# EAGLE design Layer4 (EAGLE 9.6.1)

## Sheet 1 of 2
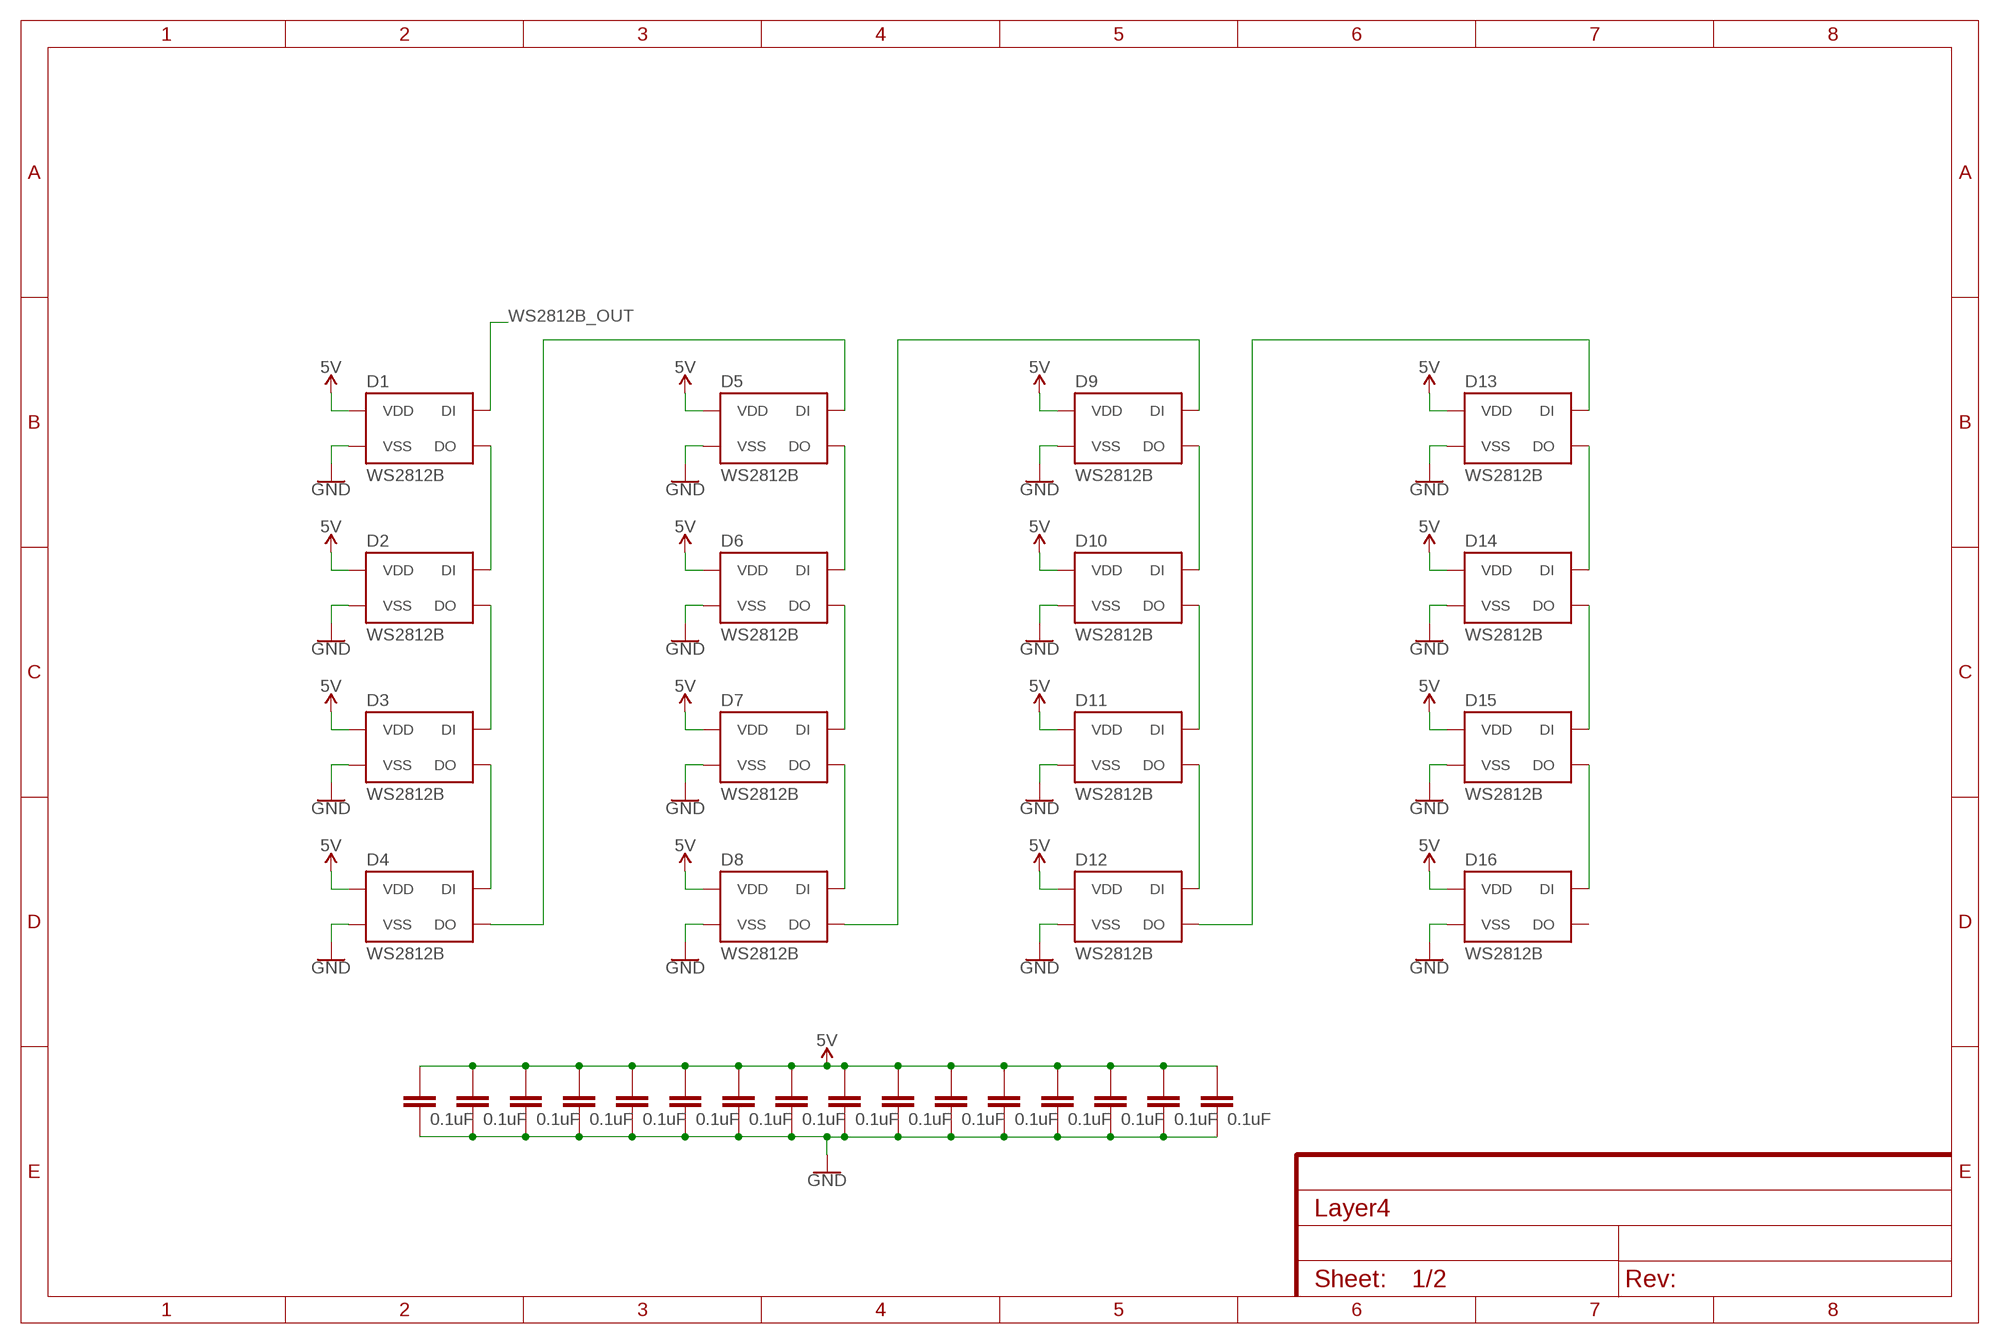
[diagram p0: schematic, sheet 1]

### Parts
AC1  0.1uF  CAPACITOR0603  [C0603]
AC2  0.1uF  CAPACITOR0603  [C0603]
AC3  0.1uF  CAPACITOR0603  [C0603]
AC4  0.1uF  CAPACITOR0603  [C0603]
AC5  0.1uF  CAPACITOR0603  [C0603]
AC6  0.1uF  CAPACITOR0603  [C0603]
AC7  0.1uF  CAPACITOR0603  [C0603]
AC8  0.1uF  CAPACITOR0603  [C0603]
C1  0.1uF  CAPACITOR0603  [C0603]
C3  0.1uF  CAPACITOR0603  [C0603]
C5  0.1uF  CAPACITOR0603  [C0603]
C7  0.1uF  CAPACITOR0603  [C0603]
C9  0.1uF  CAPACITOR0603  [C0603]
C11  0.1uF  CAPACITOR0603  [C0603]
C13  0.1uF  CAPACITOR0603  [C0603]
C15  0.1uF  CAPACITOR0603  [C0603]
D1  WS2812B  [WS2812B]
D2  WS2812B  [WS2812B]
D3  WS2812B  [WS2812B]
D4  WS2812B  [WS2812B]
D5  WS2812B  [WS2812B]
D6  WS2812B  [WS2812B]
D7  WS2812B  [WS2812B]
D8  WS2812B  [WS2812B]
D9  WS2812B  [WS2812B]
D10  WS2812B  [WS2812B]
D11  WS2812B  [WS2812B]
D12  WS2812B  [WS2812B]
D13  WS2812B  [WS2812B]
D14  WS2812B  [WS2812B]
D15  WS2812B  [WS2812B]
D16  WS2812B  [WS2812B]

### Nets
5V: AC1.1 AC2.1 AC3.1 AC4.1 AC5.1 AC6.1 AC7.1 AC8.1 C1.1 C3.1 C5.1 C7.1 C9.1 C11.1 C13.1 C15.1 D1.1(VDD) D2.1(VDD) D3.1(VDD) D4.1(VDD) D5.1(VDD) D6.1(VDD) D7.1(VDD) D8.1(VDD) D9.1(VDD) D10.1(VDD) D11.1(VDD) D12.1(VDD) D13.1(VDD) D14.1(VDD) D15.1(VDD) D16.1(VDD) ; also sheet 2
GND: AC1.2 AC2.2 AC3.2 AC4.2 AC5.2 AC6.2 AC7.2 AC8.2 C1.2 C3.2 C5.2 C7.2 C9.2 C11.2 C13.2 C15.2 D1.3(VSS) D2.3(VSS) D3.3(VSS) D4.3(VSS) D5.3(VSS) D6.3(VSS) D7.3(VSS) D8.3(VSS) D9.3(VSS) D10.3(VSS) D11.3(VSS) D12.3(VSS) D13.3(VSS) D14.3(VSS) D15.3(VSS) D16.3(VSS) ; also sheet 2
N$3: D1.2(DO) D2.4(DI)
N$5: D2.2(DO) D3.4(DI)
N$6: D3.2(DO) D4.4(DI)
N$7: D4.2(DO) D5.4(DI)
N$8: D5.2(DO) D6.4(DI)
N$9: D6.2(DO) D7.4(DI)
N$10: D7.2(DO) D8.4(DI)
N$11: D8.2(DO) D9.4(DI)
N$12: D9.2(DO) D10.4(DI)
N$13: D10.2(DO) D11.4(DI)
N$14: D11.2(DO) D12.4(DI)
N$15: D12.2(DO) D13.4(DI)
N$16: D13.2(DO) D14.4(DI)
N$17: D14.2(DO) D15.4(DI)
N$18: D15.2(DO) D16.4(DI)
WS2812B_OUT: D1.4(DI) ; also sheet 2
Unconnected: D16.2(DO)

## Sheet 2 of 2
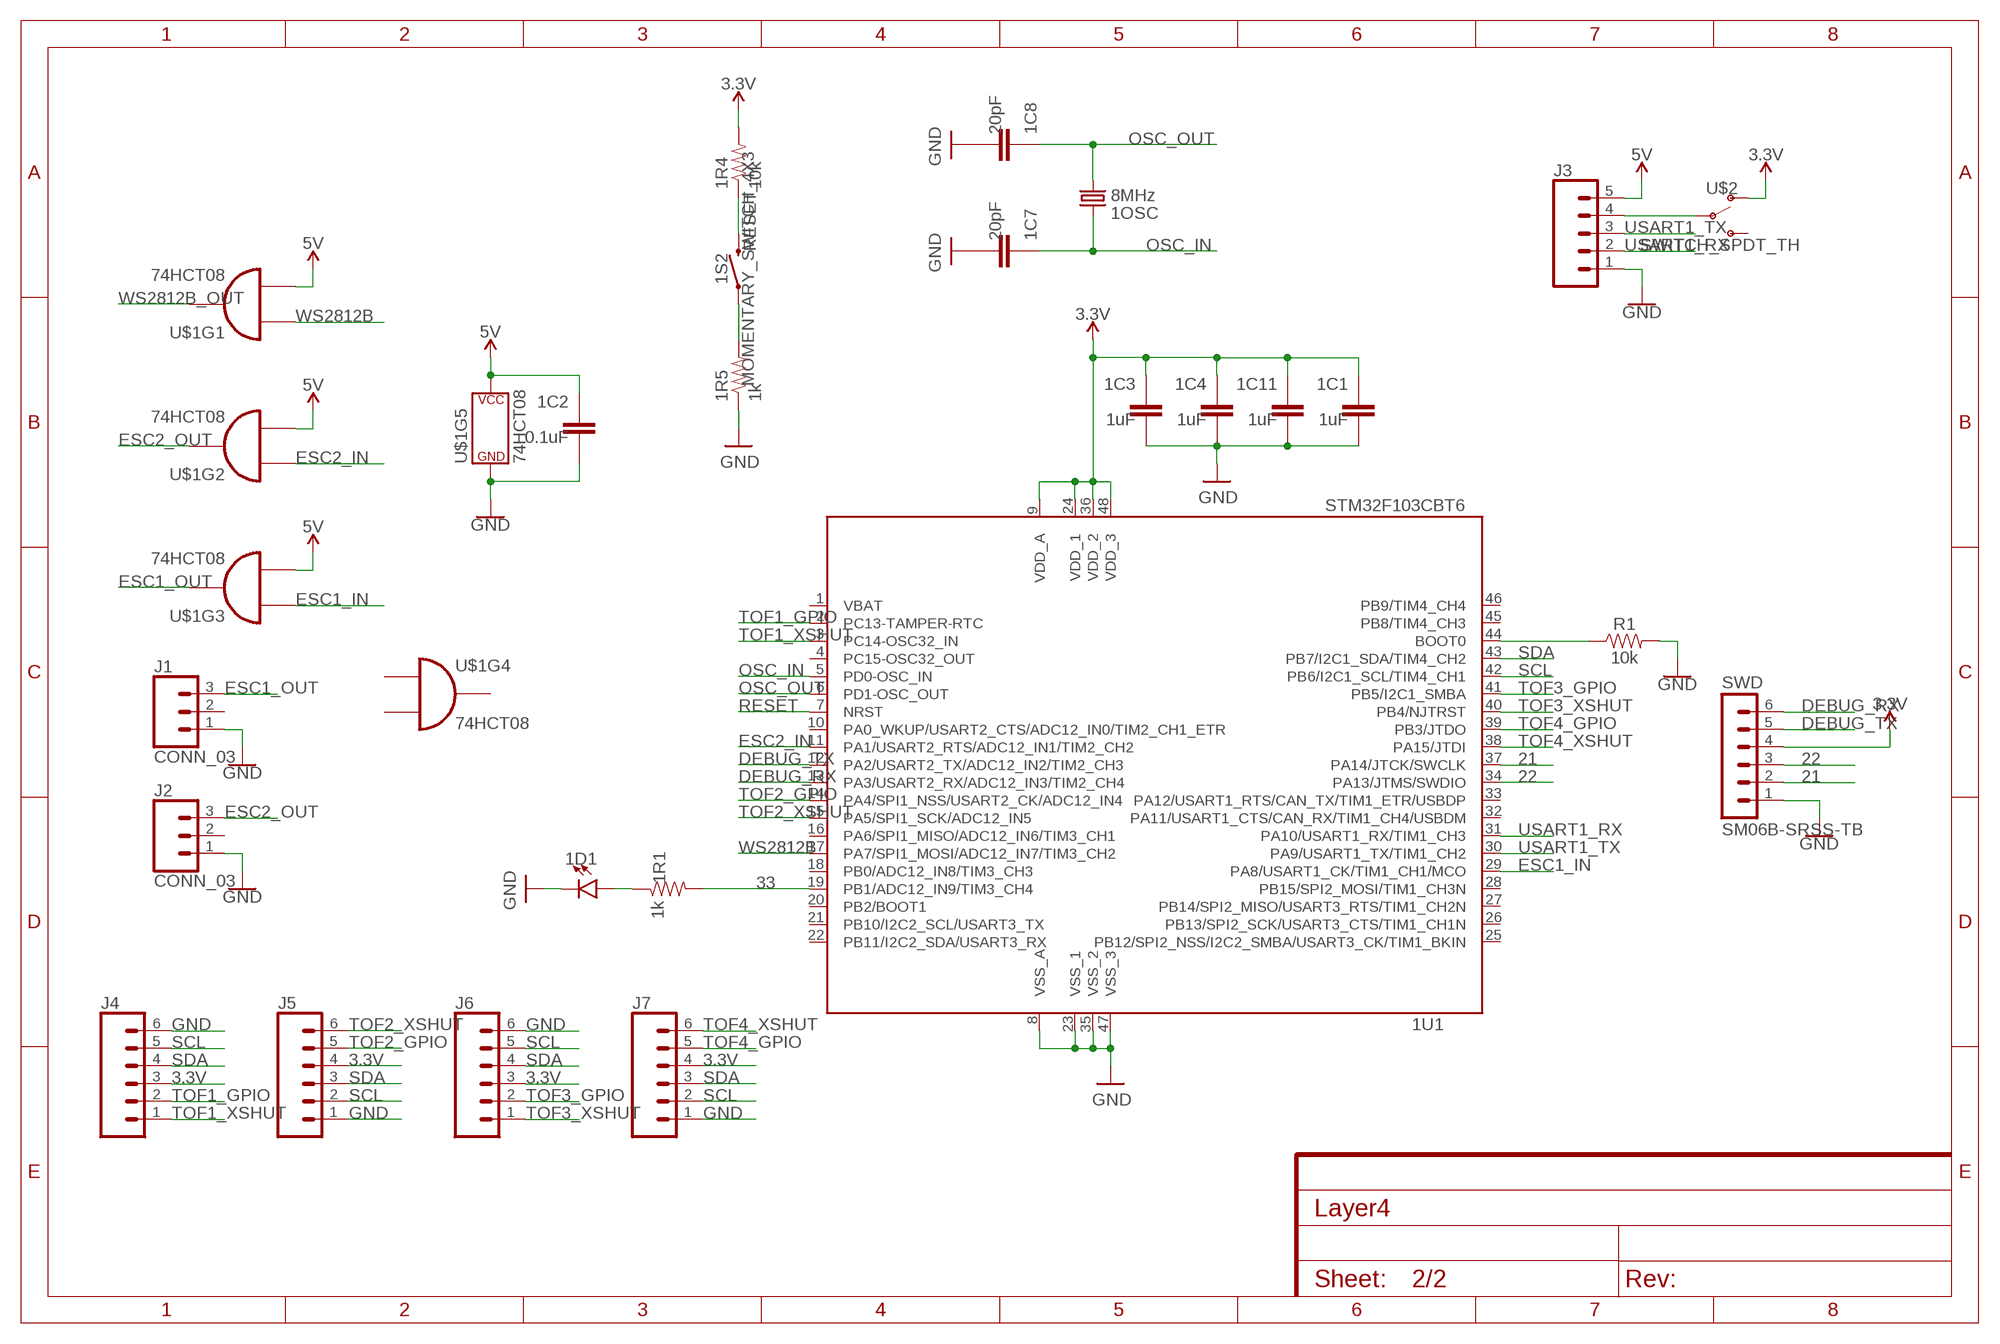
[diagram p1: schematic, sheet 2]

### Parts
1C1  1uF  CAPACITOR0603  [C0603]
1C2  0.1uF  CAPACITOR0603  [C0603]
1C3  1uF  CAPACITOR0603  [C0603]
1C4  1uF  CAPACITOR0603  [C0603]
1C7  20pF  CAPACITOR0603  [C0603]
1C8  20pF  CAPACITOR0603  [C0603]
1C11  1uF  CAPACITOR0603  [C0603]
1D1  BLUE  LED0603  [LED-0603]
1OSC  8MHz  CRYSTAL_5032  [CRYSTAL-SMD-5X3.2-2PAD]
1R1  1k  RESISTOR0603  [R0603]
1R4  10k  RESISTOR0603  [R0603]
1R5  1k  RESISTOR0603  [R0603]
1S2  MOMENTARY_SWITCH_4X3  [MOMENTARY_SWITCH_4X3]
1U1  STM32F103CBT6  [LQFP48]
J1  CONN_03  [1X03_LOCK]
J2  CONN_03  [1X03_LOCK]
J3  CONN_05LOCK  [1X05_LOCK]
J4  CONN_06LOCK  [1X06_LOCK]
J5  CONN_06LOCK  [1X06_LOCK]
J6  CONN_06LOCK  [1X06_LOCK]
J7  CONN_06LOCK  [1X06_LOCK]
R1  10k  RESISTOR0603  [R0603]
SWD  SM06B-SRSS-TB  [SM06B-SRSS-TB]
U$1  74HCT08  [SOIC-14]
U$2  SWITCH_SPDT_TH  [SWITCH_SPDT_PTH_11.6X4.0MM_LOCK]

### Nets
3.3V: 1C1.1 1C3.1 1C4.1 1C11.1 1R4.2 1U1.9(VDD_A) 1U1.24(VDD_1) 1U1.36(VDD_2) 1U1.48(VDD_3) J4.3 J5.4 J6.3 J7.4 SWD.4 U$2.1(O)
5V: 1C2.1 J3.5 U$1.P2(I1) U$1.P5(I1) U$1.P10(I1) U$1.P14(P$V+) ; also sheet 1
21: 1U1.37(PA14/JTCK/SWCLK) SWD.2
22: 1U1.34(PA13/JTMS/SWDIO) SWD.3
33: 1R1.2 1U1.19(PB1/ADC12_IN9/TIM3_CH4)
DEBUG_RX: 1U1.13(PA3/USART2_RX/ADC12_IN3/TIM2_CH4) SWD.6
DEBUG_TX: 1U1.12(PA2/USART2_TX/ADC12_IN2/TIM2_CH3) SWD.5
ESC1_IN: 1U1.29(PA8/USART1_CK/TIM1_CH1/MCO) U$1.P9(I0)
ESC1_OUT: J1.3 U$1.P8(O)
ESC2_IN: 1U1.11(PA1/USART2_RTS/ADC12_IN1/TIM2_CH2) U$1.P4(I0)
ESC2_OUT: J2.3 U$1.P6(O)
GND: 1C1.2 1C2.2 1C3.2 1C4.2 1C7.2 1C8.2 1C11.2 1D1.C 1R5.1 1U1.8(VSS_A) 1U1.23(VSS_1) 1U1.35(VSS_2) 1U1.47(VSS_3) J1.1 J2.1 J3.1 J4.6 J5.1 J6.6 J7.1 R1.2 SWD.1 U$1.P7(P$V-) ; also sheet 1
N$2: 1D1.A 1R1.1
N$4: 1R5.2 1S2.P$1
N$23: 1U1.44(BOOT0) R1.1
N$26: J3.4 U$2.2(P)
OSC_IN: 1C7.1 1OSC.P$2 1U1.5(PD0-OSC_IN)
OSC_OUT: 1C8.1 1OSC.P$1 1U1.6(PD1-OSC_OUT)
RESET: 1R4.1 1S2.P$2 1U1.7(NRST)
SCL: 1U1.42(PB6/I2C1_SCL/TIM4_CH1) J4.5 J5.2 J6.5 J7.2
SDA: 1U1.43(PB7/I2C1_SDA/TIM4_CH2) J4.4 J5.3 J6.4 J7.3
TOF1_GPIO: 1U1.2(PC13-TAMPER-RTC) J4.2
TOF1_XSHUT: 1U1.3(PC14-OSC32_IN) J4.1
TOF2_GPIO: 1U1.14(PA4/SPI1_NSS/USART2_CK/ADC12_IN4) J5.5
TOF2_XSHUT: 1U1.15(PA5/SPI1_SCK/ADC12_IN5) J5.6
TOF3_GPIO: 1U1.41(PB5/I2C1_SMBA) J6.2
TOF3_XSHUT: 1U1.40(PB4/NJTRST) J6.1
TOF4_GPIO: 1U1.39(PB3/JTDO) J7.5
TOF4_XSHUT: 1U1.38(PA15/JTDI) J7.6
USART1_RX: 1U1.31(PA10/USART1_RX/TIM1_CH3) J3.2
USART1_TX: 1U1.30(PA9/USART1_TX/TIM1_CH2) J3.3
WS2812B: 1U1.17(PA7/SPI1_MOSI/ADC12_IN7/TIM3_CH2) U$1.P1(I0)
WS2812B_OUT: U$1.P3(O) ; also sheet 1
Unconnected: 1U1.4(PC15-OSC32_OUT) 1U1.10(PA0_WKUP/USART2_CTS/ADC12_IN0/TIM2_CH1_ETR) 1U1.16(PA6/SPI1_MISO/ADC12_IN6/TIM3_CH1) 1U1.18(PB0/ADC12_IN8/TIM3_CH3) 1U1.20(PB2/BOOT1) 1U1.21(PB10/I2C2_SCL/USART3_TX) 1U1.22(PB11/I2C2_SDA/USART3_RX) 1U1.25(PB12/SPI2_NSS/I2C2_SMBA/USART3_CK/TIM1_BKIN) 1U1.26(PB13/SPI2_SCK/USART3_CTS/TIM1_CH1N) 1U1.27(PB14/SPI2_MISO/USART3_RTS/TIM1_CH2N) 1U1.28(PB15/SPI2_MOSI/TIM1_CH3N) 1U1.32(PA11/USART1_CTS/CAN_RX/TIM1_CH4/USBDM) 1U1.33(PA12/USART1_RTS/CAN_TX/TIM1_ETR/USBDP) 1U1.45(PB8/TIM4_CH3) 1U1.46(PB9/TIM4_CH4) J1.2 J2.2 U$1.P11(O) U$1.P12(I0) U$1.P13(I1) U$2.3(S)

## Power pins joined to a net without a drawn wire
VBAT: 1U1.1(VBAT)

## Library data of the parts
1C1-1C4 1C7 1C8 1C11 AC1-AC8 C1 C3 C5 C7 C9 C11 C13 C15 = JH:CAPACITOR
1D1 = JH:LED: Blue SMD LED Used in manufacturing of various products at SparkFun Packages: 0603 - SMD 0603 package [Product Link] <http://www.digikey.com/product-detail/en/SMLE12BC7TT86/511-1589-2-ND/1641808> 1206 - SMD1206 package [Product Link] <http://www.digikey.com/product-detail/en/lite-on-inc/LTST-C150TBKT/160-1643-1-ND/573584> SparkFun Products: ESP8266 Thing-Dev Board <https://www.sparkfun.com/products/13711> RedBoard <https://www.sparkfun.com/products/12757>
1OSC = JH:CRYSTAL: Crystals (Generic) These are passive quartz crystals, which can be used as a clock source for a microcontroller. Crystal's are two-terminal devices. They require external "load" capacitors to generate an oscillating signal.
1R1 1R4 1R5 R1 = JH:RESISTOR
1S2 = JH:MOMENTARY_SWITCH_4X3
1U1 = JH:STM32F103CBT6
D1-D16 = JH:WS2812B
J1 J2 = JH:CONN_03
J3 = Connectors:CONN_05: Multi connection point. Often used as Generic Header-pin footprint for 0.1 inch spaced/style header connections On any of the 0.1 inch spaced packages, you can populate with these: Break Away Headers - Straight <https://www.sparkfun.com/products/116> (PRT-00116) Break Away Male Headers - Right Angle <https://www.sparkfun.com/products/553> (PRT-00553) Female Headers <https://www.sparkfun.com/products/115> (PRT-00115) Break Away Headers - Machine Pin <https://www.sparkfun.com/products/117> (PRT-00117) Break Away Female Headers - Swiss Machine Pin <https://www.sparkfun.com/products/743> (PRT-00743) For SCREWTERMINALS and SPRING TERMINALS visit here: Screw Terimnals on SparkFun.com <https://www.sparkfun.com/search/results?term=Screw+Terminals> (5mm/3.5mm/2.54mm spacing) This device is also useful as a general connection point to wire up your design to another part of your project. Our various solder wires solder well into these plated through hole pads. Hook-Up Wire - Assortment (Stranded, 22 AWG) <https://www.sparkfun.com/products/11375> (PRT-11375) Hook-Up Wire - Assortment (Solid Core, 22 AWG) <https://www.sparkfun.com/products/11367> (PRT-11367) View the entire wire category on our website here <https://www.sparkfun.com/categories/141> Special notes: Molex polarized connector foot print use with SKU : PRT-08231 with associated crimp pins and housings. 1MM SMD Version SKU: PRT-10208
J4-J7 = Connectors:CONN_06: Multi connection point. Often used as Generic Header-pin footprint for 0.1 inch spaced/style header connections On any of the 0.1 inch spaced packages, you can populate with these: Break Away Headers - Straight <https://www.sparkfun.com/products/116> (PRT-00116) Break Away Male Headers - Right Angle <https://www.sparkfun.com/products/553> (PRT-00553) Female Headers <https://www.sparkfun.com/products/115> (PRT-00115) Break Away Headers - Machine Pin <https://www.sparkfun.com/products/117> (PRT-00117) Break Away Female Headers - Swiss Machine Pin <https://www.sparkfun.com/products/743> (PRT-00743) Arduino Stackable Header - 6 Pin <https://www.sparkfun.com/products/9280> (PRT-09280) For SCREWTERMINALS and SPRING TERMINALS visit here: Screw Terimnals on SparkFun.com <https://www.sparkfun.com/search/results?term=Screw+Terminals> (5mm/3.5mm/2.54mm spacing) This device is also useful as a general connection point to wire up your design to another part of your project. Our various solder wires solder well into these plated through hole pads. Hook-Up Wire - Assortment (Stranded, 22 AWG) <https://www.sparkfun.com/products/11375> (PRT-11375) Hook-Up Wire - Assortment (Solid Core, 22 AWG) <https://www.sparkfun.com/products/11367> (PRT-11367) View the entire wire category on our website here <https://www.sparkfun.com/categories/141>
SWD = con-JST SH:SM06B-SRSS: JST SH series header 1.00mm pitch disconnectable crimp style connectors, horizontal (side entry type), 6 pins
U$1 = JH:74HCT08
U$2 = JH:SWITCH_SPDT

## Board
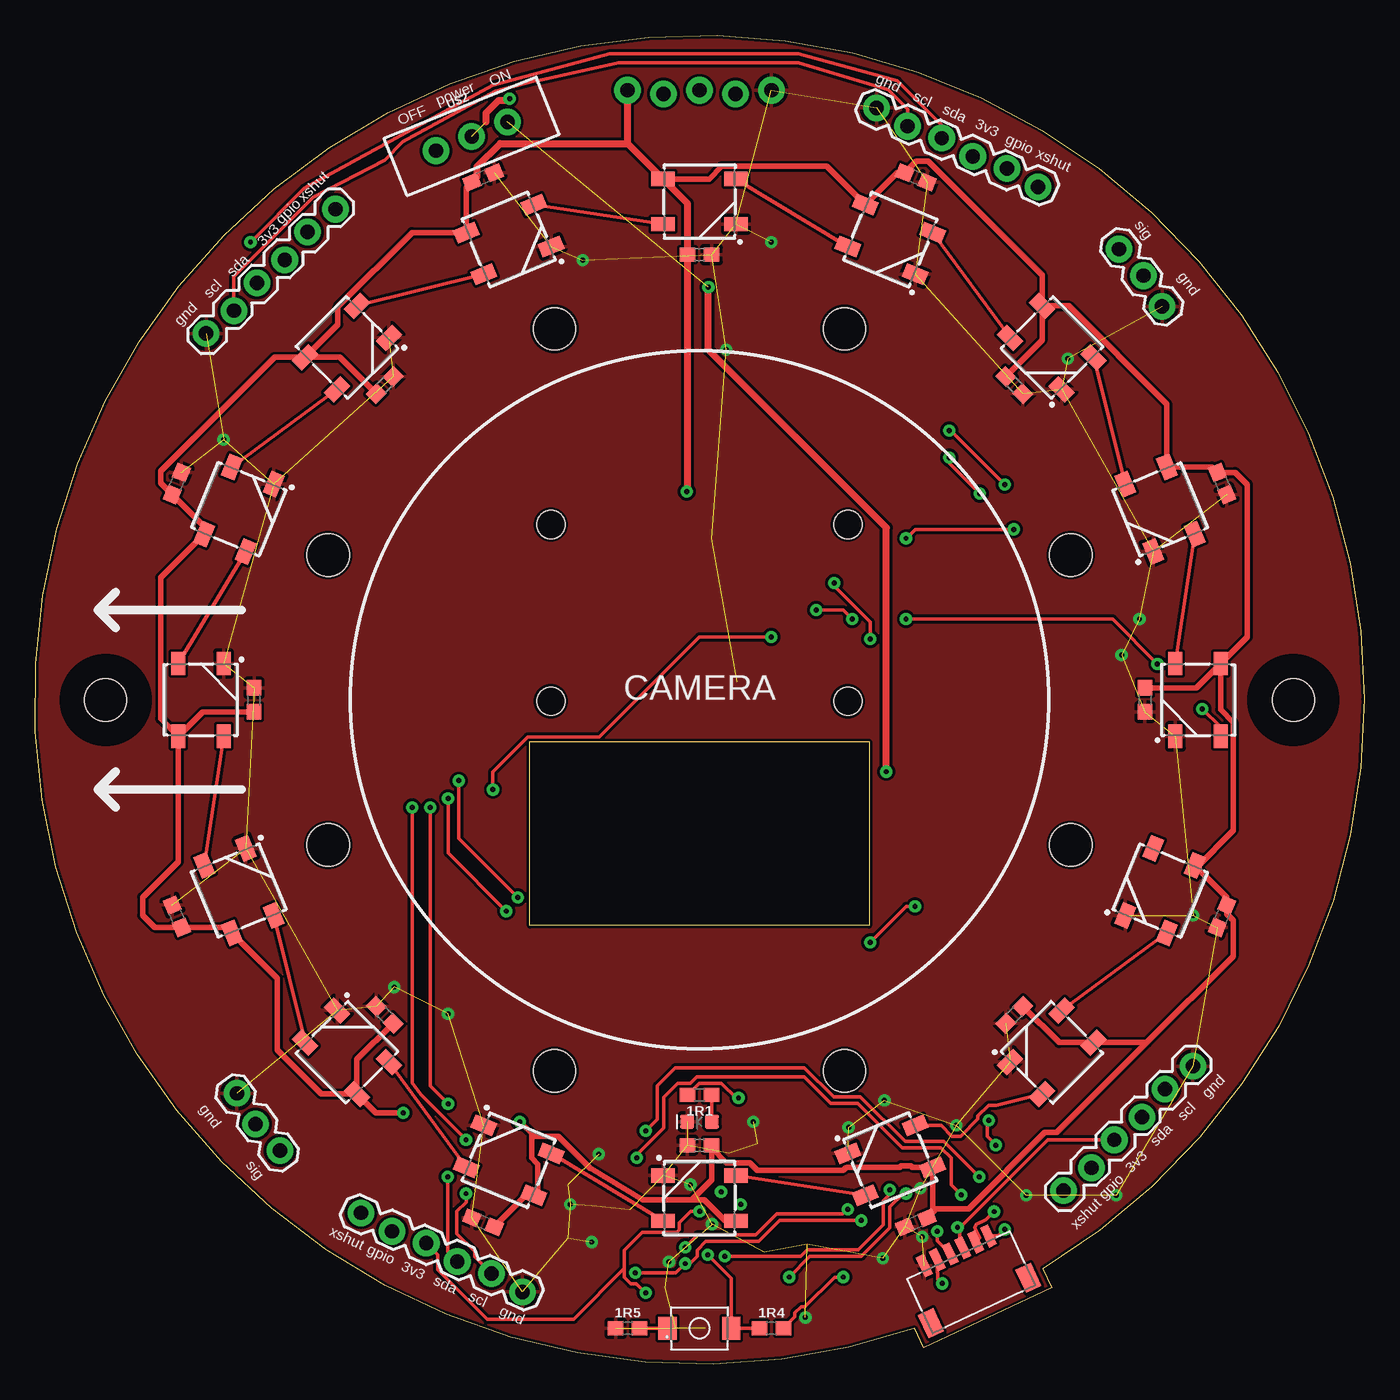
[diagram p2: board, top side]
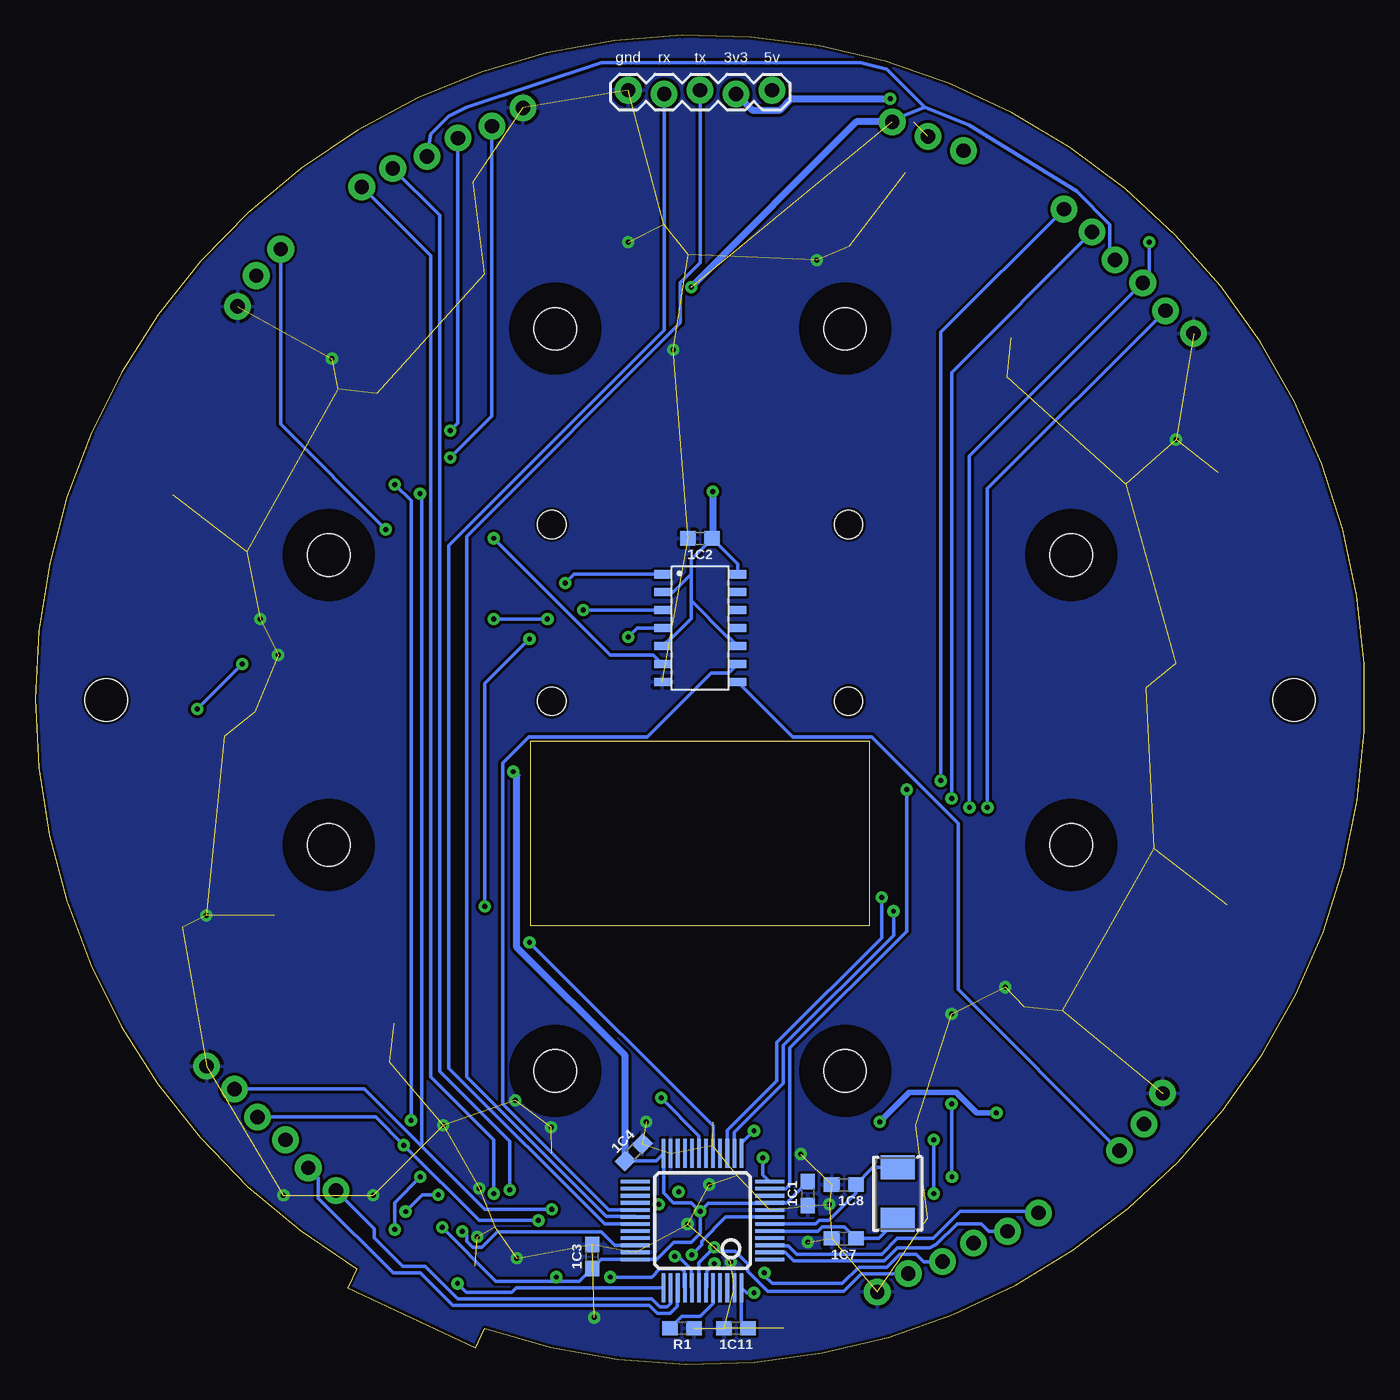
[diagram p3: board, bottom side, seen from below]

Size 93.97 x 94 mm. Coordinates in mm from the lower left corner, seen from the top.
Outline: 71.88,5.39 62.82,1.16 62.18,2.52 arc-348 71.25,6.75 71.88,5.39
Outline: 34.96,44.03 58.96,44.03 58.96,31.03 34.96,31.03 34.96,44.03
Copper layers (1*16): Top 0.035mm / dielectric 1.5mm / Bottom 0.035mm
Design rules "mine *": minimum track width 10mil, minimum drill 10mil, track to track 8mil, track to pad 8mil, pad to pad 8mil, via to via 8mil, smd to smd 8mil, copper to edge 8mil, drill to drill 8mil, minimum pad ring 12mil, minimum via ring 10mil, stop-mask expansion 4mil, vias tented up to drill 25mil, thermal gap 10mil
Holes 3 mm at 4.96,46.99 20.71,36.74 20.71,57.24 36.71,73.24 57.21,73.24 73.21,57.24 73.21,36.74 57.21,20.74 36.71,20.74 88.96,46.99
Holes 2 mm at 57.46,59.39 57.46,46.89 36.46,46.89 36.46,59.39
tKeepout: 24 lines
bKeepout: 24 lines
tRestrict: area 2,44 to 8,50; area 86,44 to 92,50
bRestrict: area 17.7,54.2 to 23.7,60.2; area 17.7,33.7 to 23.7,39.7; area 33.7,17.7 to 39.7,23.7; area 54.2,17.7 to 60.2,23.7; area 70.2,33.7 to 76.2,39.7; area 70.2,54.2 to 76.2,60.2; area 54.2,70.2 to 60.2,76.2; area 33.7,70.2 to 39.7,76.2
Milling: 4 lines

### Footprints (pad centres in the part's own frame; a part is rotated, then mirrored left to right if it is on the bottom)
C0603 = smd 1.1 x 1: 1 -0.85,0; 2 0.85,0
LED-0603 = smd 1 x 1: A -0.877,0; C 0.877,0
CRYSTAL-SMD-5X3.2-2PAD = smd 1.7 x 2.4: P$1 1.85,0; P$2 -1.85,0
R0603 = smd 1.1 x 1: 1 -0.85,0; 2 0.85,0
MOMENTARY_SWITCH_4X3 = smd 1.3 x 1.6: P$1 -2.25,0; P$2 2.25,0
LQFP48 = smd 0.254 x 2.032: 1 -2.75,-4.758; 2 -2.25,-4.758; 3 -1.75,-4.758; 4 -1.25,-4.758; 5 -0.75,-4.758; 6 -0.25,-4.758; 7 0.25,-4.758; 8 0.75,-4.758; 9 1.25,-4.758; 10 1.75,-4.758; 11 2.25,-4.758; 12 2.75,-4.758; 25 2.75,4.758; 26 2.25,4.758; 27 1.75,4.758; 28 1.25,4.758; 29 0.75,4.758; 30 0.25,4.758; 31 -0.25,4.758; 32 -0.75,4.758; 33 -1.25,4.758; 34 -1.75,4.758; 35 -2.25,4.758; 36 -2.75,4.758 | smd 2.032 x 0.254: 13 4.758,-2.75; 14 4.758,-2.25; 15 4.758,-1.75; 16 4.758,-1.25; 17 4.758,-0.75; 18 4.758,-0.25; 19 4.758,0.25; 20 4.758,0.75; 21 4.758,1.25; 22 4.758,1.75; 23 4.758,2.25; 24 4.758,2.75; 37 -4.758,2.75; 38 -4.758,2.25; 39 -4.758,1.75; 40 -4.758,1.25; 41 -4.758,0.75; 42 -4.758,0.25; 43 -4.758,-0.25; 44 -4.758,-0.75; 45 -4.758,-1.25; 46 -4.758,-1.75; 47 -4.758,-2.25; 48 -4.758,-2.75
WS2812B = smd 1.651 x 1: 1 2.577,-1.6; 2 2.577,1.6; 3 -2.577,1.6; 4 -2.577,-1.6
1X03_LOCK = drill 1.016 pad 1.88: 1 0,0.127; 2 2.54,-0.127; 3 5.08,0.127
1X05_LOCK = drill 1.016 pad 1.88: 1 0,0.127; 2 2.54,-0.127; 3 5.08,0.127; 4 7.62,-0.127; 5 10.16,0.127
1X06_LOCK = drill 1.016 pad 1.88: 1 0,0; 2 2.54,-0.254; 3 5.08,0; 4 7.62,-0.254; 5 10.16,0; 6 12.7,-0.254
SM06B-SRSS-TB = smd 0.6 x 1.55: 1 2.5,0; 2 1.5,0; 3 0.5,0; 4 -0.5,0; 5 -1.5,0; 6 -2.5,0 | smd 1.2 x 1.8: M1 3.8,3.875; M2 -3.8,3.875
SOIC-14 = smd 1.18 x 0.58: P1 -2.66,3.81; P2 -2.66,2.54; P3 -2.66,1.27; P4 -2.66,0; P5 -2.66,-1.27; P6 -2.66,-2.54; P7 -2.66,-3.81; P8 2.66,-3.81; P9 2.66,-2.54; P10 2.66,-1.27; P11 2.66,0; P12 2.66,1.27; P13 2.66,2.54; P14 2.66,3.81
SWITCH_SPDT_PTH_11.6X4.0MM_LOCK = drill 1.016 pad 1.88: 1 0,2.718; 2 0,0; 3 0,-2.718

### Placement (x,y rotation side)
1C1  39.34,12.07 270 bottom
1C2  46.96,58.42 180 bottom
1C3  54.58,7.62 90 bottom
1C4  51.66,14.99 45 bottom
1C7  36.8,8.89 180 bottom
1C8  36.8,12.7 180 bottom
1C11  44.42,2.54 180 bottom
1D1  46.96,17.15 180 top
1OSC  32.99,12.07 90 bottom
1R1  46.96,19.05 180 top
1R4  52.04,2.54 0 top
1R5  41.88,2.54 0 top
1S2  46.96,2.54 0 top
1U1  46.79,10.16 90 bottom
AC1  83.92,62.3 292.5 top
AC2  62.27,83.95 337.5 top
AC3  31.66,83.95 22.5 top
AC4  10.01,62.3 67.5 top
AC5  10.01,31.68 112.5 top
AC6  31.66,10.04 157.5 top
AC7  62.27,10.04 202.5 top
AC8  83.92,31.68 247.5 top
C1  78.46,46.99 270 top
C3  69.24,69.26 315 top
C5  46.96,78.49 0 top
C7  24.69,69.26 45 top
C9  15.46,46.99 90 top
C11  24.69,24.72 135 top
C13  46.96,15.49 180 top
C15  69.24,24.72 225 top
D1  82.21,46.99 90 top
D2  79.53,60.48 112.5 top
D3  71.89,71.92 135 top
D4  60.45,79.56 157.5 top
D5  46.96,82.24 180 top
D6  33.47,79.56 202.5 top
D7  22.04,71.92 225 top
D8  14.4,60.48 247.5 top
D9  11.71,46.99 270 top
D10  14.4,33.5 292.5 top
D11  22.04,22.07 315 top
D12  33.47,14.42 337.5 top
D13  46.96,11.74 0 top
D14  60.45,14.42 22.5 top
D15  71.89,22.07 45 top
D16  79.53,33.5 67.5 top
J1  14.15,19.08 307 top
J2  79.78,74.9 127 top
J3  52.04,89.99 0 bottom
J4  23.04,10.7 335 top
J5  12.07,72.91 45 top
J6  70.89,83.28 155 top
J7  81.86,21.08 225 top
R1  48.23,2.54 0 bottom
SWD  65.14,8.02 205 top
U$1  46.96,52.07 0 bottom
U$2  30.86,86.86 292 top

### Tracks (layer width: path | path; a pad name or v marks a point on that pad's centre or on a via)
3.3V  (via drill 0.35)  (1 unrouted)
  Top 0.254: J7.4 71.61,15.87 65.38,9.64 65.38,9.5 | 41.65,6.77 41.65,6.14 42.1,5.7 42.5,5.7 v43.15,5.04 | 41.65,6.77 41.65,8.04 42.92,9.31 45.35,9.31 45.54,9.5 45.54,10.01 46.33,10.8 v46.96,10.8 v46.97,10.8 | J4.3 28.46,7.73 28.46,6.68 31.97,3.18 38.06,3.18 41.65,6.77 | SWD.4 65.38,8.44 65.38,9.5 | v65.21,9.67 65.38,9.5 | v57.12,6.16 56.52,6.16 54.42,4.06 54.14,4.06 53.7,3.62 53.7,3.34 1R4.2
  Top 0.508: v60.18,41.91 60.18,59.18 47.6,71.76 v47.6,76.2
  Bottom 0.254: 1C11.1 44.04,3.01 1U1.48 43.68,5.04 v43.15,5.04 | 1C4.1 50.08,14.39 1U1.24 49.54,12.11 48.87,11.43 47.6,11.43 v46.97,10.8 | 1C1.1 40.85,11.41 1U1.9 42.08,11.37 46.4,11.37 v46.97,10.8 | J6.3 66.01,87 64.74,88.27 63.47,88.9 53.95,92.08 35.59,92.08 33.78,91.59 31.09,88.9 | J5.4 17.98,78.46 17.98,80.62 20.34,82.98 27.91,87.63 31.09,88.9 | v46.97,10.8 46.97,9.26 47.6,8.63 48.81,8.63 50.03,7.41 1U1.36 53.94,7.41 1C3.1 55.5,5.86 56.82,5.86 | 31.09,88.9 33.63,87.88 | v65.21,9.67 61.4,5.86 56.82,5.86 | v57.12,6.16 56.82,5.86
  Bottom 0.508: 1C4.1 52.26,21.83 59.92,29.48 59.92,41.65 v60.18,41.91 | 33.63,87.88 35.92,87.88 v47.6,76.2
5V  (via drill 0.35)
  Top 0.381: D3.1 71.2,72.43 C3.1 | D1.1 82.09,47.84 C1.1 | D16.1 82.11,35.15 | 82.11,35.15 84.24,33.02 AC8.1 84.24,31.84 84.69,31.39 84.69,28.84 78.61,22.76 | C15.1 72.4,22.76 D15.1 78.61,22.76 | AC6.1 34.69,11.96 D12.1 35.53,12.25 35.53,14.15 35.09,14.59 35.09,16.32 | D11.1 22.73,21.55 C11.1 | C9.1 11.84,46.14 D9.1 | D7.1 21.53,71.23 C7.1 | AC3.1 30.48,83.23 D6.1 26.65,80.05 21.4,74.8 21.4,73.54 D7.1 | D9.1 10.11,35.54 7.59,33.02 7.59,31.75 8.45,30.9 AC5.1 13.52,30.9 D10.1 17.12,27.29 17.12,22.23 20.23,19.11 D11.1 | D9.1 8.86,45.66 8.86,55.64 D8.1 11.93,59.26 AC4.1 8.86,62.33 8.86,63.17 16.92,71.23 D7.1 | D5.1 47.66,83.84 48.55,84.73 55.97,84.73 D4.1 60.93,84.27 AC2.1 62.31,85.09 63.14,85.09 71.2,77.03 D3.1 | D3.1 73.06,74.87 80.02,67.91 D2.1 83.2,63.47 AC1.1 84.85,63.08 85.7,62.23 85.7,51.45 D1.1 | D1.1 83.81,46.3 84.71,45.4 84.71,37.74 82.11,35.15 | 78.61,22.76 72.24,16.39 71.39,16.39 66,11 63.69,11 AC7.1 63.45,10.75 D14.1 62.01,13.93 61.91,14.03 61.23,14.03 61.13,13.93 57.42,13.93 57.29,13.88 57.12,13.71 51.05,13.71 50.53,14.23 48.87,14.23 47.81,15.29 | 47.81,15.29 C13.1 | 46.41,11.62 47.81,13.02 47.81,15.29 | D13.1 48.79,10.14 47.31,11.62 46.41,11.62 | D11.1 24.06,17.78 v26.01,17.78 | v34.26,17.15 35.09,16.32 | 39.26,13.84 42.94,11.62 46.41,11.62 | 35.09,16.32 35.29,16.12 36.97,16.12 39.23,13.86 39.26,13.84 | 39.26,13.84
  Top 0.508: v46.08,61.72 46.11,61.76 C5.1 46.11,82.11 D5.1 41.88,86.34 | AC3.1 31.25,84 31.25,84.73 32.86,86.34 41.88,86.34 | 41.88,86.34 J3.5
  Bottom 0.254: U$1.P14 44.3,56.61 1C2.1 47.6,56.94 47.6,55.88 | 47.6,55.88 48.87,54.61 U$1.P2 | U$1.P10 44.95,51.45 45.03,51.45 47.6,54.02 | 47.6,54.02 47.6,55.88 | U$1.P5 48.97,51.45 48.9,51.45 47.6,52.75 47.6,54.02
  Bottom 0.381: v26.01,17.78 27.39,17.78 28.84,19.24 32.17,19.24 v34.26,17.15
  Bottom 0.508: v46.08,61.72 46.08,58.46 1C2.1
21  (via drill 0.35)
  Top 0.254: SWD.2 63.78,6.51 63.83,6.46 63.83,6 v64.12,5.71
  Bottom 0.254: 1U1.37 59.98,5.4 60.3,5.08 63.49,5.08 v64.12,5.71
22  (via drill 0.35)
  Top 0.254: v63.77,9.4 63.77,8.72 SWD.3
  Bottom 0.254: 1U1.34 53.01,8.41 53.95,9.35 61.31,9.35 62.4,8.26 63.03,8.26 63.47,8.7 63.47,9.1 v63.77,9.4
33  (via drill 0.35)
  Top 0.254: v49.72,18.83 49.55,18.83 48.5,19.88 46.94,19.88 1R1.2
  Bottom 0.254: 1U1.19 47.04,16.15 v49.72,18.83
DEBUG_RX  (via drill 0.35)
  Top 0.254: v43.15,16.51 43.96,17.32 43.96,19.69 45.25,20.97 54.38,20.97 56.45,18.91 58.35,18.91 61.5,15.75 64.23,15.75 v66.74,13.24 | v68.55,9.53 68.1,9.08 SWD.6
  Bottom 0.254: 1U1.13 44.04,15.62 v43.15,16.51 | v66.74,13.24 68.55,11.43 v68.55,9.53
DEBUG_TX  (via drill 0.35)
  Top 0.254: SWD.5 66.77,8.93 66.45,9.64 66.54,9.89 67.2,10.2 v67.8,10.8 | v65.47,11.97 64.76,12.69 64.76,14.58 64.04,15.3 61.31,15.3 58.16,18.45 56.26,18.45 54.37,20.34 46.76,20.34 46.3,19.88 45.69,19.88 45.44,19.88 45.43,19.88 44.42,18.87 44.42,16.7 42.52,14.8 v42.52,14.61
  Bottom 0.254: v67.8,10.8 66.62,11.97 v65.47,11.97 | v42.52,14.61 42.52,13.39 1U1.12
ESC1_IN
  Bottom 0.254: U$1.P9 44.95,48.88 46.17,48.88 50.69,44.36 59.1,44.36 60.93,42.53 60.93,18.42 53.43,10.91 1U1.29
ESC1_OUT
  Bottom 0.254: J1.3 28.71,26.51 28.71,38.25 34.83,44.36 40.41,44.36 U$1.P8
ESC2_IN  (via drill 0.35)
  Top 0.254: v52.04,51.44 46.96,51.44 39.89,44.36 34.83,44.36 32.36,41.9 v32.36,40.64
  Bottom 0.254: U$1.P4 51.41,52.07 v52.04,51.44 | v32.36,40.64 32.36,30.63 40.61,22.37 40.61,12.7 40.9,12.41 1U1.11
ESC2_OUT  (via drill 0.35)
  Top 0.254: v61.57,58.42 62.2,59.06 v69.19,59.06
  Bottom 0.254: U$1.P6 50.27,50.18 53.33,50.18 v61.57,58.42 | v69.19,59.06 76.62,66.48 J2.3
GND  (via drill 0.35)  (80 unrouted)
  other vias: 37.82,11.3 39.34,8.64 54.46,3.3 52.04,79.38 50.77,17.15 13.31,65.41 73,71.12 81.89,31.75 62.59,12.45 62.71,9.02 46.33,12.7 47.85,9.91 39.85,14.86 25.37,26.67 29.18,24.77 48.87,71.76 38.71,78.11 76.81,50.17 78.08,52.71 65.13,16.89 60.05,18.67 44.81,7.24 59.92,7.49 57.51,16.76 70.08,11.94 76.43,11.94
  pour Bottom (isolate 0.203): -0.03,93.98 93.95,93.98 93.95,0 -0.03,0
  pour Top (isolate 0.203): 93.95,93.98 -0.03,93.98 -0.03,0 93.95,0
N$1  (via drill 0.35)
  other vias: 48.49,12.19
N$2
  Top 0.254: 1R1.1 47.84,19.02 1D1.A
N$3
  Top 0.254: D1.2 D2.4
N$4
  Top 0.254: 1R5.2 1S2.P$1
N$5
  Top 0.254: D2.2 D3.4
N$6
  Top 0.254: D3.2 D4.4
N$7
  Top 0.254: D4.2 D5.4
N$8
  Top 0.254: D5.2 D6.4
N$9
  Top 0.254: D6.2 D7.4
N$10
  Top 0.254: D7.2 D8.4
N$11
  Top 0.254: D8.2 D9.4
N$12
  Top 0.254: D9.2 D10.4
N$13
  Top 0.254: D10.2 D11.4
N$14
  Top 0.254: D11.2 D12.4
N$15
  Top 0.254: D12.2 D13.4
N$16
  Top 0.254: D13.2 D14.4
N$17
  Top 0.254: D15.4 67.95,18.31 67.41,18.31 66.65,17.55 66.65,17.34 65.44,16.13 64.81,16.13 64.06,16.89 D14.2
N$18
  Top 0.254: D15.2 D16.4
N$23
  Bottom 0.254: 1U1.44 46.04,4.29 46.97,3.37 48.25,3.37 R1.1
N$24  (via drill 0.35)
  other vias: 49.89,11.3
N$26  (via drill 0.35)  (1 unrouted)
  Top 0.508: v33.53,89.52 33.4,89.39 32.75,89.39 31.86,88.5 31.86,87.87
  Bottom 0.508: v33.53,89.52 40.51,89.52 41.31,88.72 43.28,88.72 J3.4
OSC_IN
  Bottom 0.254: 1OSC.P$2 34.32,8.89 1C7.1 36.78,9.72 38.34,9.72 38.65,9.41 1U1.5
OSC_OUT
  Bottom 0.254: 1OSC.P$1 34.74,13.92 1C8.1 35.95,12.1 37.87,10.18 38.53,10.18 38.8,9.91 1U1.6
RESET  (via drill 0.35)
  Top 0.254: 1R4.1 1S2.P$2 49.21,6.08 v47.55,7.75
  Bottom 0.254: 1U1.7 45.14,10.41 46.84,8.71 46.84,8.45 v47.55,7.75
SCL  (via drill 0.35)
  Top 0.254: v45.96,8.27 46.83,9.13 50.95,9.13 52.43,10.62 57.11,10.62 v57.45,10.96 | v66.77,61.6 64.62,63.75 v64.62,64.14 | J6.5 61.68,88.79 60.3,90.17 53.95,92.08 41.25,92.08 35.53,90.81 35.37,90.81 32.53,90.03 25.99,86.47 24.7,85.17 19.66,82.55 14.04,76.94 J5.2 | v26.64,39.37 26.64,19.9 27.26,19.07 v30.45,15.88 | J4.5 31.06,7.59 31.06,7.97 29.81,9.22 29.81,10.8 30.45,11.44 v30.45,12.07
  Bottom 0.254: J4.5 35.56,6.41 36.8,5.17 42.2,5.17 43.59,6.56 43.59,7.09 44.49,8 45.69,8 v45.96,8.27 47.04,7.18 1U1.42 | v57.45,10.96 62.2,10.96 66.65,15.4 | v66.77,61.6 66.65,61.47 66.65,15.4 | v64.62,64.14 61.68,67.07 J6.5 | 66.65,15.4 70.71,19.46 J7.2 | J5.2 26.64,61.92 v26.64,39.37 | v30.45,15.88 v30.45,12.07
SDA  (via drill 0.35)
  Top 0.254: v42.41,6.46 45.29,6.46 v45.95,7.12 46.29,7.12 46.79,7.62 46.79,8.06 47.4,8.68 51.14,8.68 52.62,10.16 v58.39,10.16 | v67.92,15.49 67.3,16.12 67.3,17.13 v67.41,17.24 | v68.55,62.23 64.74,66.04 v64.62,66.04 | J6.4 64.09,87.65 60.93,90.81 53.95,92.71 40.61,92.71 32.36,90.46 19.02,83.19 v15.21,79.38 | v27.91,39.37 27.91,19.69 v29.18,18.42 | J4.4 29.15,7.94 v29.15,13.26
  Bottom 0.254: J4.4 31.15,7.25 31.68,7.78 32.83,7.78 33.75,6.87 35.75,6.87 36.9,5.72 41.88,5.72 42.41,6.26 v42.41,6.46 | v58.39,10.16 62.59,10.16 v67.92,15.49 69.91,17.48 J7.3 | v67.41,17.24 67.41,61.08 v68.55,62.23 | v64.62,66.04 64.09,66.57 J6.4 | v15.21,79.38 15.21,76.94 J5.3 27.91,64.24 v27.91,39.37 | v29.15,13.26 29.15,18.38 v29.18,18.42 | 1U1.43 46.5,5.45 46.5,6.56 v45.95,7.11 v45.95,7.12
TOF1_GPIO
  Bottom 0.254: J4.2 26.54,9.4 27.07,9.93 28.78,9.93 30.25,8.46 30.72,8.24 33.02,8.24 33.94,7.32 40.34,7.32 40.93,7.91 1U1.2
TOF1_XSHUT
  Bottom 0.254: J4.1 23.04,10.8 28.56,10.8 30.47,8.89 31.72,8.89 33.02,8.89 34.13,7.78 40.13,7.78 40.72,8.37 41.99,8.37 1U1.3
TOF2_GPIO  (via drill 0.35)
  Top 0.254: v33.29,32.04 29.18,36.15 v29.18,40.01
  Bottom 0.254: 1U1.14 44.54,16.39 41.07,19.86 41.07,22.56 33.29,30.35 v33.29,32.04 | v29.18,40.01 29.18,70.16 J5.5
TOF2_XSHUT  (via drill 0.35)
  Top 0.254: v29.94,41.28 29.94,37.2 v34.12,33.02
  Bottom 0.254: J5.6 29.94,72.99 v29.94,41.28 | 1U1.15 45.04,16.54 41.53,20.05 41.53,22.75 34.12,30.16 v34.12,33.02
TOF3_GPIO  (via drill 0.35)
  Top 0.254: v48.75,7.62 54.13,7.62 54.58,8.08 58.21,8.08 59.97,9.85 59.97,11.57 60.43,12.02 v60.43,12.32
  Bottom 0.254: 1U1.41 47.59,5.45 47.59,6.7 48.51,7.62 v48.75,7.62 | v60.43,12.32 60.43,15.75 65.38,20.7 65.38,81.26 J6.2
TOF3_XSHUT  (via drill 0.35)
  Top 0.254: v53.31,6.16 54.77,7.62 58.39,7.62 60.43,9.66 60.43,11.13 61.37,12.07 v61.57,12.07
  Bottom 0.254: 1U1.40 48.09,5.45 48.09,6.56 48.28,6.75 49.81,6.75 50.4,6.16 v53.31,6.16 | v61.57,12.07 61.57,15.88 66.01,20.32 66.01,78.4 J6.1
TOF4_GPIO
  Bottom 0.254: 1U1.39 48.59,5.36 48.59,4.1 49.09,3.6 50,3.6 50.56,4.17 64.47,4.17 66.76,6.46 68.68,6.46 73.97,11.75 73.97,13.19 J7.5
TOF4_XSHUT
  Bottom 0.254: J7.6 70.02,9.59 70.02,8.95 67.99,6.92 66.4,6.92 64.11,4.62 50.38,4.62 49.81,4.06 49.28,4.06 49.04,4.29 1U1.38
USART1_RX
  Bottom 0.254: J3.2 49.5,73.16 64.74,57.92 64.74,20.93 53.72,9.91 1U1.31
USART1_TX
  Bottom 0.254: J3.3 46.96,77.91 48.36,76.51 48.36,73.66 63.47,58.55 63.47,20.31 53.62,10.45 51.6,10.45 1U1.30
WS2812B  (via drill 0.35)
  Top 0.254: v59.03,29.85 61.57,32.39 v62.2,32.39 | v59.03,51.31 59.03,52.51 56.49,55.05 v56.49,55.25
  Bottom 0.254: 1U1.17 46.04,16.86 v59.03,29.85 | v62.2,32.39 62.2,48.13 v59.03,51.31 | v56.49,55.25 55.85,55.88 U$1.P1
WS2812B_OUT  (via drill 0.35)
  Top 0.254: v55.22,53.34 57.12,53.34 v57.76,52.71 | v82.52,46.36 83.81,45.07 D1.4 | v61.57,52.71 76.17,52.71 v79.35,49.53
  Bottom 0.254: U$1.P3 v55.22,53.34 | v79.35,49.53 v82.52,46.36 | v57.76,52.71 v61.57,52.71

### Text on the board
tPlace: ON | power | gnd | scl | OFF | sda | 3v3 | gpio | xshut | xshut | gpio | 3v3 | sig | sda | scl | gnd | gnd | CAMERA | gnd | gnd | scl | sda | 3v3 | sig | gpio | xshut | xshut | gpio | 3v3 | sda | scl | gnd
bPlace: 5v | 3v3 | tx | rx | gnd